# Altium project DevBOB.PrjPcb
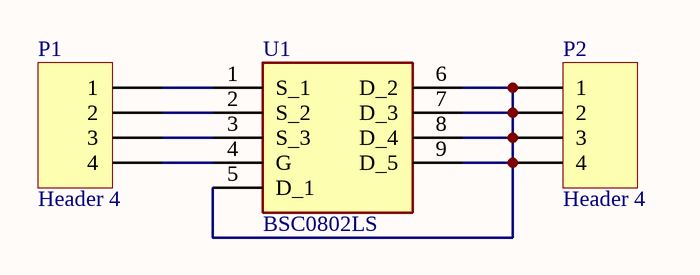
[diagram p0: BSC0802BOB.SchDoc]
2 sheets, 6 parts. Net scope: global (net labels, ports and power ports of the same name join across sheets).
Board files: BSC0802BOB.PcbDoc, DevBOBPanel.PcbDoc, LMG1210BOB.PcbDoc
Sheets:
  BSC0802BOB.SchDoc
  LMG1210BOB.SchDoc

## Sheet BSC0802BOB.SchDoc
size A4

### Parts
P1  Header 4  [HDR1X4]
P2  Header 4  [HDR1X4]
U1  BSC0802LS  [TDSON-8]

### Nets
NetP1_1: P1.1 U1.1(S_1)
NetP1_2: P1.2 U1.2(S_2)
NetP1_3: P1.3 U1.3(S_3)
NetP1_4: P1.4 U1.4(G)
NetP2_1: P2.1 P2.2 P2.3 P2.4 U1.5(D_1) U1.6(D_2) U1.7(D_3) U1.8(D_4) U1.9(D_5)

### Library data of the parts
P1 P2 = Header 4: Header, 4-Pin; LatestRevisionDate: 17-Jul-2002; LatestRevisionNote: Re-released for DXP Platform.; Publisher: Altium Limited

## Sheet LMG1210BOB.SchDoc
size A4
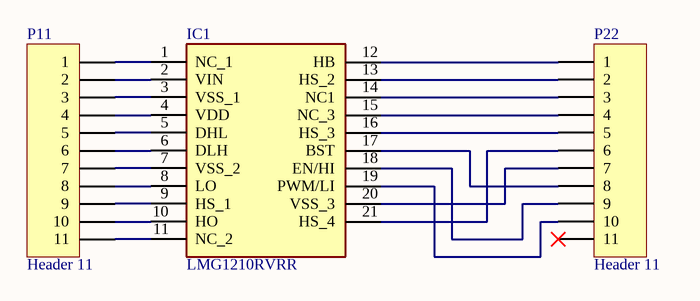
[diagram p1: LMG1210BOB.SchDoc]

### Parts
IC1  LMG1210RVRR  [LMG1210RVRR]
P11  Header 11  [HDR1X11]
P22  Header 11  [HDR1X11]

### Nets
NetIC1_1: IC1.1(NC_1) P11.1
NetIC1_2: IC1.2(VIN) P11.2
NetIC1_3: IC1.3(VSS_1) P11.3
NetIC1_4: IC1.4(VDD) P11.4
NetIC1_5: IC1.5(DHL) P11.5
NetIC1_6: IC1.6(DLH) P11.6
NetIC1_7: IC1.7(VSS_2) P11.7
NetIC1_8: IC1.8(LO) P11.8
NetIC1_9: IC1.9(HS_1) P11.9
NetIC1_10: IC1.10(HO) P11.10
NetIC1_11: IC1.11(NC_2) P11.11
NetIC1_12: IC1.12(HB) P22.1
NetIC1_13: IC1.13(HS_2) P22.2
NetIC1_14: IC1.14(NC1) P22.3
NetIC1_15: IC1.15(NC_3) P22.4
NetIC1_16: IC1.16(HS_3) P22.5
NetIC1_17: IC1.17(BST) P22.8
NetIC1_18: IC1.18(EN/HI) P22.9
NetIC1_19: IC1.19(PWM/LI) P22.10
NetIC1_20: IC1.20(VSS_3) P22.7
NetIC1_21: IC1.21(HS_4) P22.6

Not connected (* = marked no-connect by the designer): P22 11*

### Library data of the parts
IC1 = LMG1210RVRR: Integrated Circuit; Manufacturer_Name: Texas Instruments; Datasheet Link: http://www.ti.com/lit/ds/symlink/lmg1210.pdf; Height: 0.8mm; Manufacturer_Part_Number: LMG1210RVRR; Arrow Part Number: LMG1210RVRR; Arrow Price/Stock: https://www.arrow.com/en/products/lmg1210rvrr/texas-instruments; Mouser Part Number: 595-LMG1210RVRR; Mouser Price/Stock: https://www.mouser.co.uk/ProductDetail/Texas-Instruments/LMG1210RVRR?qs=r5DSvlrkXmKqI241KOY62g%3D%3D
P11 P22 = Header 11: Header, 11-Pin; LatestRevisionDate: 17-Jul-2002; LatestRevisionNote: Re-released for DXP Platform.; Publisher: Altium Limited